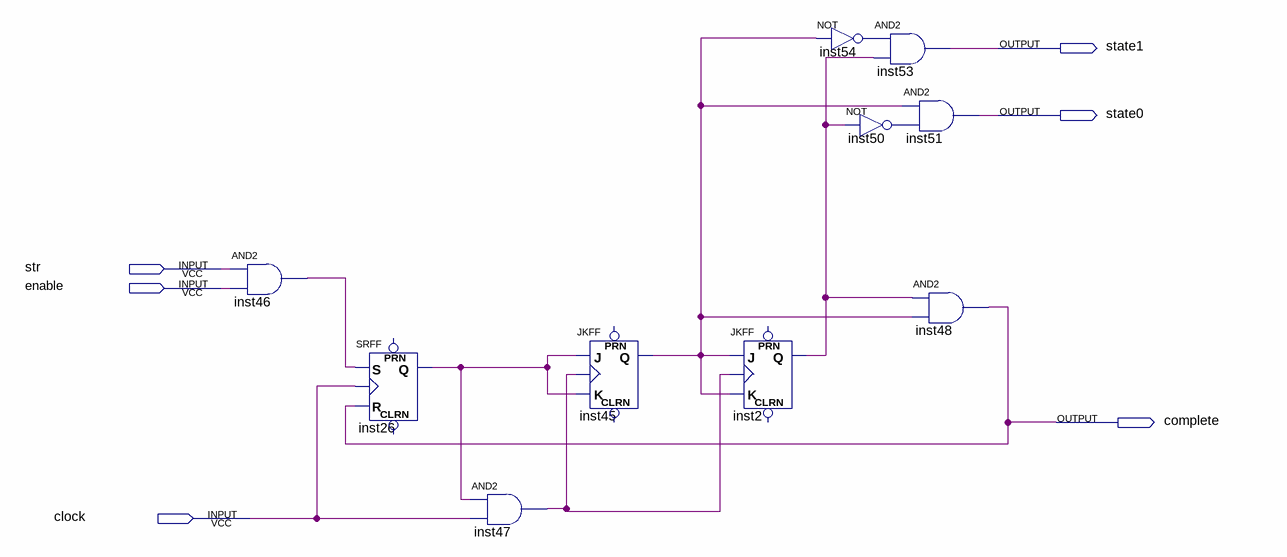
[diagram p0: schematic sheet]
// Quartus schematic str_decode.bdf as structural Verilog: 10 symbols, 6 pins
module str_decode (
  input  str,
  input  enable,
  input  clock,
  output state1,
  output state0,
  output complete
);

  wire inst2_q, inst26_q, inst45_q, inst46_out, inst47_out, inst50_out, inst54_out;

  and inst46 (inst46_out, str, enable);
  SRFF inst26 (.S(inst46_out), .R(complete), .CLK(clock), .Q(inst26_q));  // open: PRN, CLRN
  and inst47 (inst47_out, inst26_q, clock);
  JKFF inst45 (.K(inst26_q), .J(inst26_q), .CLK(inst47_out), .Q(inst45_q));  // open: PRN, CLRN
  JKFF inst2 (.K(inst45_q), .J(inst45_q), .CLK(inst47_out), .Q(inst2_q));  // open: PRN, CLRN
  and inst53 (state1, inst54_out, inst2_q);
  not inst54 (inst54_out, inst45_q);
  not inst50 (inst50_out, inst2_q);
  and inst51 (state0, inst45_q, inst50_out);
  and inst48 (complete, inst2_q, inst45_q);
endmodule
